# Altium project Documents.PrjPcb
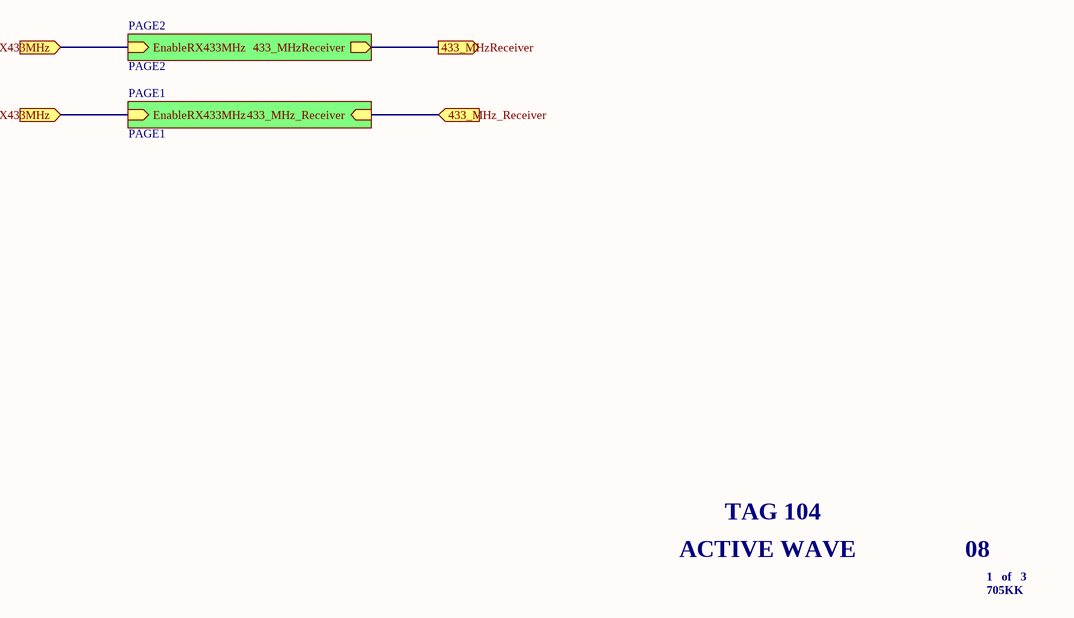
[diagram p0: Tag104 Rev8.SCHDOC]
3 sheets, 62 parts. Net scope: hierarchical (ports join the sheet entries above them; power ports are global).
Sheets:
  Tag104 Rev8.SCHDOC
    PAGE1 = PAGE1.SCHDOC
    PAGE2 = PAGE2.SCHDOC

## Sheet Tag104 Rev8.SCHDOC
size 292 x 193 mm; SheetNumber: 0; SheetTotal: 0

### Sub-sheets
PAGE1 = PAGE1: EnableRX433MHz (in), 433_MHz_Receiver (in)  | Description: PAGE1
PAGE2 = PAGE2: EnableRX433MHz (in), 433_MHzReceiver (out)  | Description: PAGE2

### Ports
433_MHz_Receiver (in), 433_MHzReceiver (out), EnableRX433MHz (in)

### Nets
(unnamed): port EnableRX433MHz, sheet PAGE1/EnableRX433MHz, sheet PAGE2/EnableRX433MHz
(unnamed): port 433_MHz_Receiver, sheet PAGE1/433_MHz_Receiver
(unnamed): port 433_MHzReceiver, sheet PAGE2/433_MHzReceiver

### Notes on the sheet
- ACTIVE WAVE
- TAG 104
- 08
- 1   of   3
- 705KK

## Sheet PAGE1.SCHDOC: Active Tag 916 Transmitter/Processor
size B; DocumentNumber: Credit Card Size Tag; Revision: 37; SheetNumber: 1; SheetTotal: 2
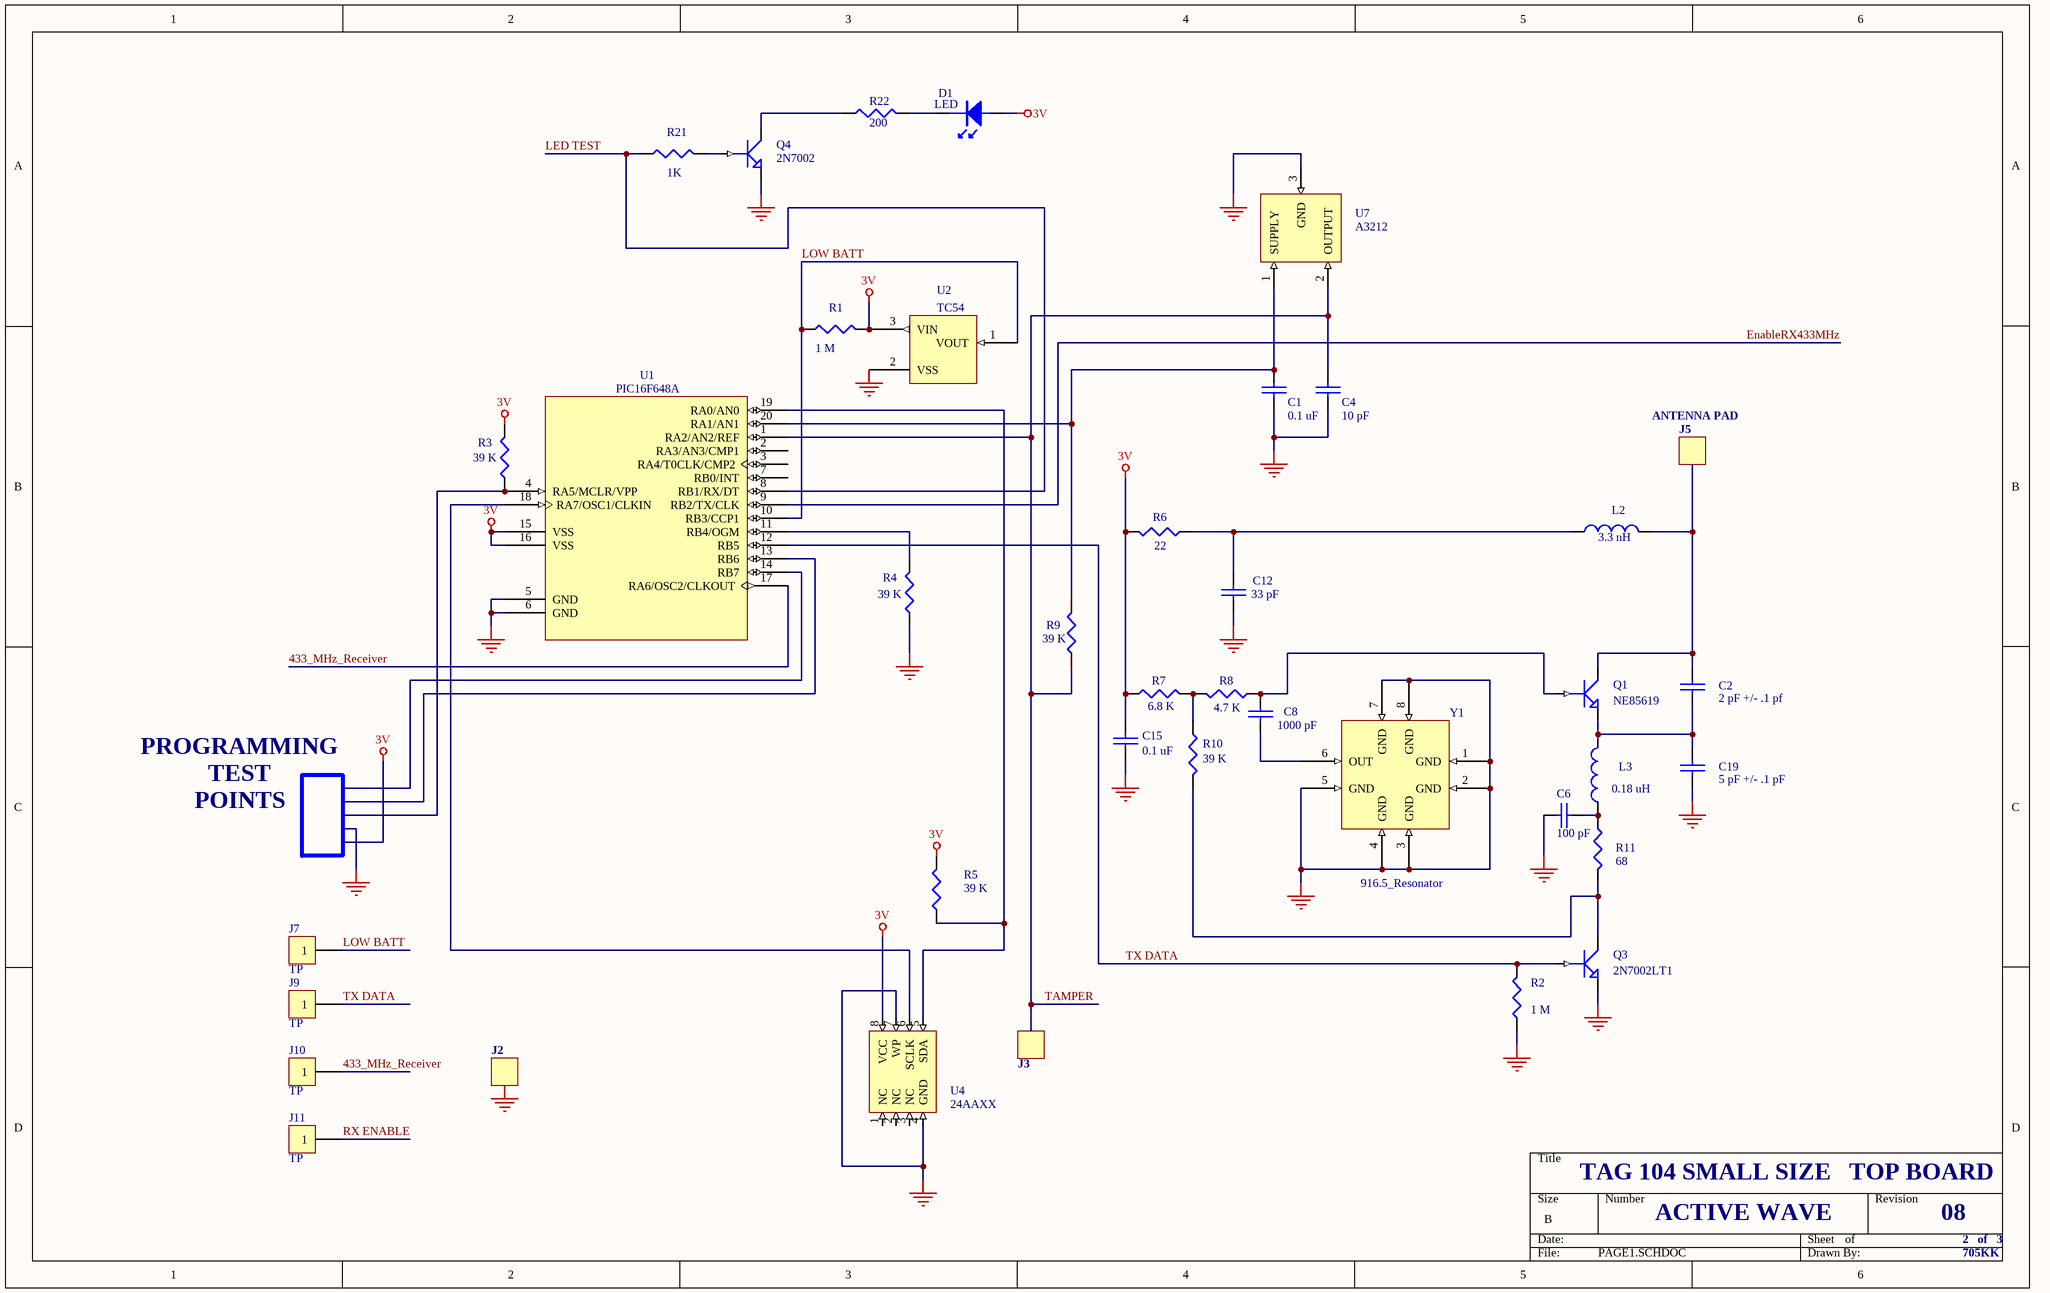
[diagram p1: PAGE1.SCHDOC]

### Parts
C1  0.1 uF  [0603]
C2  2 pF +/- .1 pf  [0603]
C4  10 pF  [0603]
C6  100 pF  [0603]
C8  1000 pF  [0603]
C12  33 pF  [0603]
C15  0.1 uF  [0603]
C19  5 pF +/- .1 pF  [0603]
D1  LED  [LED STANLEY H_1105W]
J7  TP  [TEST POINT PAD 5]
J9  TP  [TEST POINT PAD 5]
J10  TP  [TEST POINT PAD 5]
J11  TP  [TEST POINT PAD 5]
L2  3.3 nH  [0603]
L3  0.18 uH  [0603]
Q1  NE85619  [3 PIN ULTRA SUPER MINI MOLD]
Q3  2N7002LT1  [SOT23 TRANS]
Q4  2N7002  [SOT23 TRANS]
R1  1 M  [0603]
R2  1 M  [0603]
R3  39 K  [0603]
R4  39 K  [0603]
R5  39 K  [0603]
R6  22  [0603]
R7  6.8 K  [0603]
R8  4.7 K  [0603]
R9  39 K  [0603]
R10  39 K  [0603]
R11  68  [0603]
R21  1K  [0603]
R22  200  [0603]
U1  PIC16F648A  [SSOP20 WIDE]
U2  TC54  [SOT23]
U4  24AAXX  [SO8]
U7  A3212  [SOT23W]
Y1  916.5_Resonator  [RESONATOR]

### Nets
3V: C15.1 D1.A R1.2 R3.2 R5.2 R6.2 R7.1 U1.15(VSS) U1.16(VSS) U2.3(VIN) U4.8(VCC)
GND_SIGNAL: C1.2 C4.2 C6.1 C12.2 C15.2 C19.2 Q3.E Q4.E R2.1 R4.1 U1.5(GND) U1.6(GND) U2.2(VSS) U4.4(GND) U4.7(WP) U7.3(GND) Y1.1(GND) Y1.2(GND) Y1.3(GND) Y1.4(GND) Y1.5(GND) Y1.7(GND) Y1.8(GND)
433_MHz_Receiver: J10.1 U1.17(RA6/OSC2/CLKOUT)
EnableRX433MHz: U1.9(RB2/TX/CLK)
LED TEST: R21.1 U1.8(RB1/RX/DT)
LOW BATT: J7.1 R1.1 U1.10(RB3/CCP1) U2.1(VOUT)
RX ENABLE: J11.1
TAMPER: C4.1 R9.1 U1.1(RA2/AN2/REF) U7.2(OUTPUT)
TX DATA: J9.1 Q3.B R2.2 U1.12(RB5)
NetC1_1: C1.1 R9.2 U1.20(RA1/AN1) U7.1(SUPPLY)
NetC2_1: C2.1 L2.2 Q1.C
NetC2_2: C2.2 C19.1 L3.2 Q1.E
NetC6_2: C6.2 L3.1 R11.1
NetC8_1: C8.1 Q1.B R8.1
NetC8_2: C8.2 Y1.6(OUT)
NetC12_1: C12.1 L2.1 R6.1
NetD1_K: D1.K R22.2
NetQ3_C: Q3.C R10.2 R11.2
NetQ4_B: Q4.B R21.2
NetQ4_C: Q4.C R22.1
NetR3_1: R3.1 U1.4(RA5/MCLR/VPP)
NetR4_2: R4.2 U1.11(RB4/OGM)
NetR5_1: R5.1 U1.19(RA0/AN0) U4.5(SDA)
NetR7_2: R7.2 R8.2 R10.1
NetU1_18: U1.18(RA7/OSC1/CLKIN) U4.6(SCLK)

Not connected (* = marked no-connect by the designer): U1 2(RA3/AN3/CMP1) 3(RA4/T0CLK/CMP2) 7(RB0/INT) 13(RB6) 14(RB7); U4 1(NC) 2(NC) 3(NC)

### Notes on the sheet
- ANTENNA PAD
- J5
- PROGRAMMING
- POINTS
- TEST
- J2
- J3
- TAG 104 SMALL SIZE   TOP BOARD
- ACTIVE WAVE
- 08
- 2   of   3
- 705KK
- Labels drawn without touching a wire or pin: GND_SIGNAL

### Library data of the parts
C1 C2 C4 C6 C8 C12 C15 C19 = CAP: Capacitor
J7 J9-J11 = CON1: Connector
L2 L3 = INDUCTOR: Text Field1: 20; Text Field2: 40
Q1 Q3 Q4 = NPN1: NPN Transistor
R1-R10 R21 = RESISTOR: Text Field1: 20; Text Field2: 30
R11 R22 = RES1
U1 = PIC16F68A/SSOP: Text Field1: 150; Text Field2: 180
U2 = TC54_1: Text Field1: 50; Text Field2: 50
U4 = 24AA256
U7 = HALL EFFECT SWITCH
Y1 = RESONATOR

## Sheet PAGE2.SCHDOC: Active Tag 433.92 MHz Receiver
size B; DocumentNumber: Crdit Card Size Tag; Revision: 37; SheetNumber: 2; SheetTotal: 2
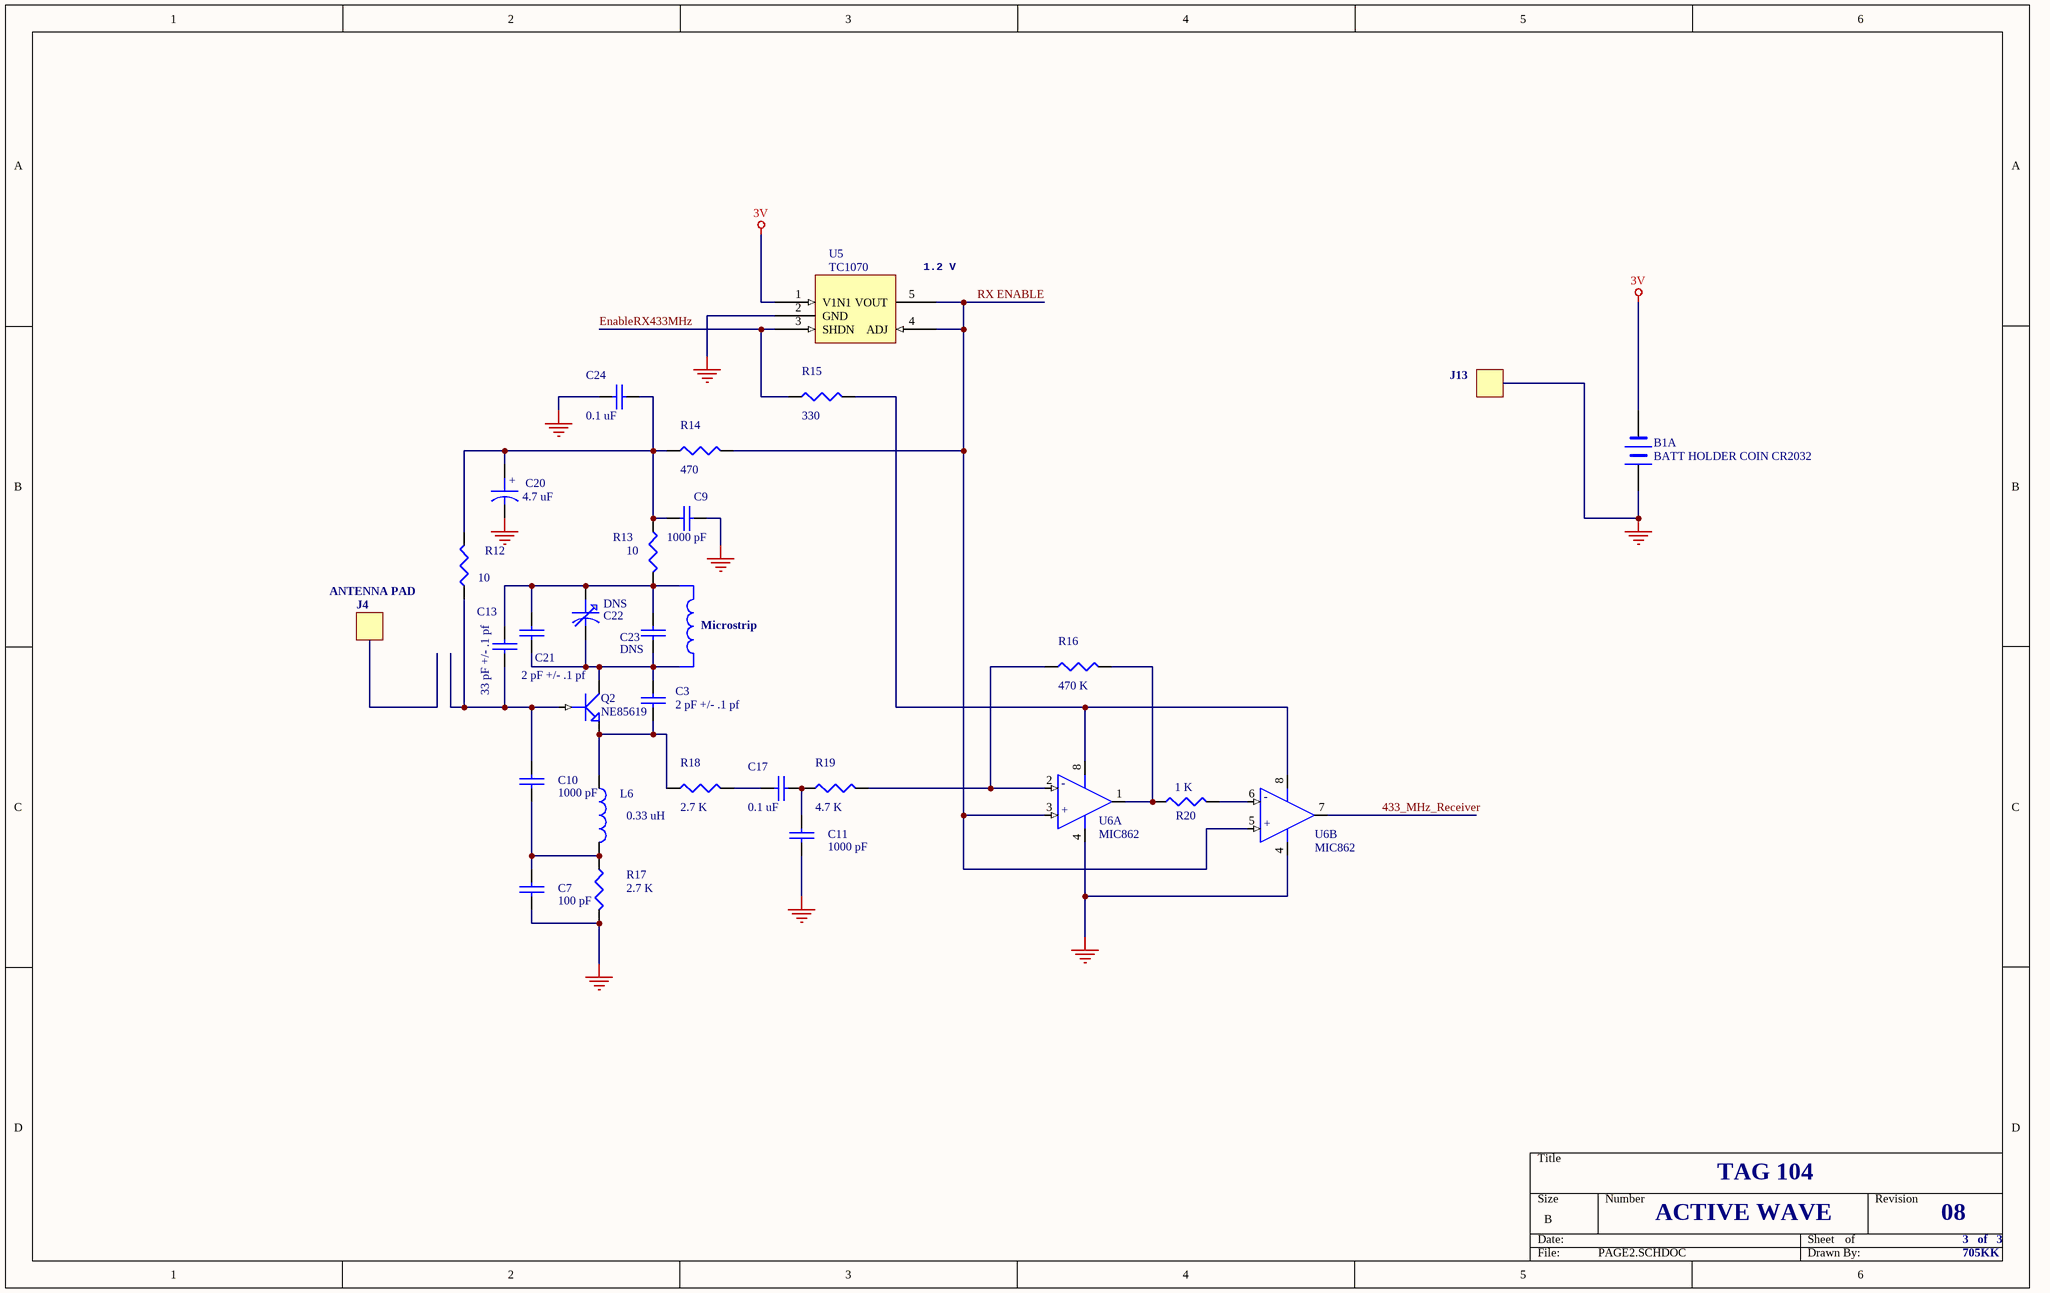
[diagram p2: PAGE2.SCHDOC]

### Parts
B1A  BATT HOLDER COIN CR2032  [BATT HOLDER COIN CR2032]
C3  2 pF +/- .1 pf  [0603]
C7  100 pF  [0603]
C9  1000 pF  [0603]
C10  1000 pF  [0603]
C11  1000 pF  [0603]
C13  33 pF +/- .1 pf  [0603]
C17  0.1 uF  [0603]
C20  4.7 uF  [CAP A CASE]
C21  2 pF +/- .1 pf  [0603]
C22  DNS  [0603]
C23  DNS  [0603]
C24  0.1 uF  [0603]
L6  0.33 uH  [0603]
Q2  NE85619  [3 PIN ULTRA SUPER MINI MOLD]
R12  10  [0603]
R13  10  [0603]
R14  470  [0603]
R15  330  [0603]
R16  470 K  [0603]
R17  2.7 K  [0603]
R18  2.7 K  [0603]
R19  4.7 K  [0603]
R20  1 K  [0603]
U5  TC1070  [SOT23-5A]
U6  MIC862  [SOT23-8]  (parts A,B of 2)

### Nets
3V: B1A.2(-) U5.1(V1N1)
GND_SIGNAL: B1A.1(+) C7.2 C9.2 C11.2 C20.2 C24.1 R17.2 U5.2(GND) U6.4(VSS)
433_MHz_Receiver: U6.7(OUT)
EnableRX433MHz: R15.1 U5.3(SHDN)
RX ENABLE: R14.2 U5.4(ADJ) U5.5(VOUT) U6.3(+) U6.5(+)
NetC3_1: C3.1 C21.2 C22.2 C23.2 Q2.C
NetC3_2: C3.2 L6.1 Q2.E R18.1
NetC7_1: C7.1 C10.2 L6.2 R17.1
NetC9_1: C9.1 C20.1 C24.2 R12.2 R13.1 R14.1
NetC10_1: C10.1 C13.1 Q2.B R12.1
NetC11_1: C11.1 C17.2 R19.1
NetC13_2: C13.2 C21.1 C22.1 C23.1 R13.2
NetC17_1: C17.1 R18.2
NetR15_2: R15.2 U6.8(VDD)
NetR16_1: R16.1 R19.2 U6.2(-)
NetR16_2: R16.2 R20.1 U6.1(OUT)
NetR20_2: R20.2 U6.6(-)

### Notes on the sheet
- (near U5) 1.2 V
- J13
- ANTENNA PAD
- J4
- Microstrip
- TAG 104
- ACTIVE WAVE
- 08
- 3   of   3
- 705KK
- (in symbol CAPACITOR POL/SM) +

### Library data of the parts
B1A = BATTERY
C3 C7 C9-C11 C13 C17 C21 C23 C24 = CAP: Capacitor
C20 = CAPACITOR POL/SM: Text Field1: 20; Text Field2: 20
C22 = CAPACITOR VAR: Text Field1: 20; Text Field2: 20
L6 = INDUCTOR: Text Field1: 20; Text Field2: 40
Q2 = NPN1: NPN Transistor
R12-R16 R18-R20 = R: Text Field1: 20; Text Field2: 30
R17 = RESISTOR: Text Field1: 20; Text Field2: 30
U5 = TC1070-2: Text Field1: 60; Text Field2: 50
U6 = MIC862: Text Field1: 40; Text Field2: 40

## Nets that join several sheets
3V: PAGE1 (11 pins), PAGE2 (B1A.2 U5.1)
GND_SIGNAL: PAGE1 (23 pins), PAGE2 (9 pins)